# Altium schematic sheet USB_HUB1 DN PORT 3.SchDoc: USB_HUB 3.0
size A2; DrawnBy: Luca Schenetti; Revision: A; SheetNumber: 7; SheetTotal: 10
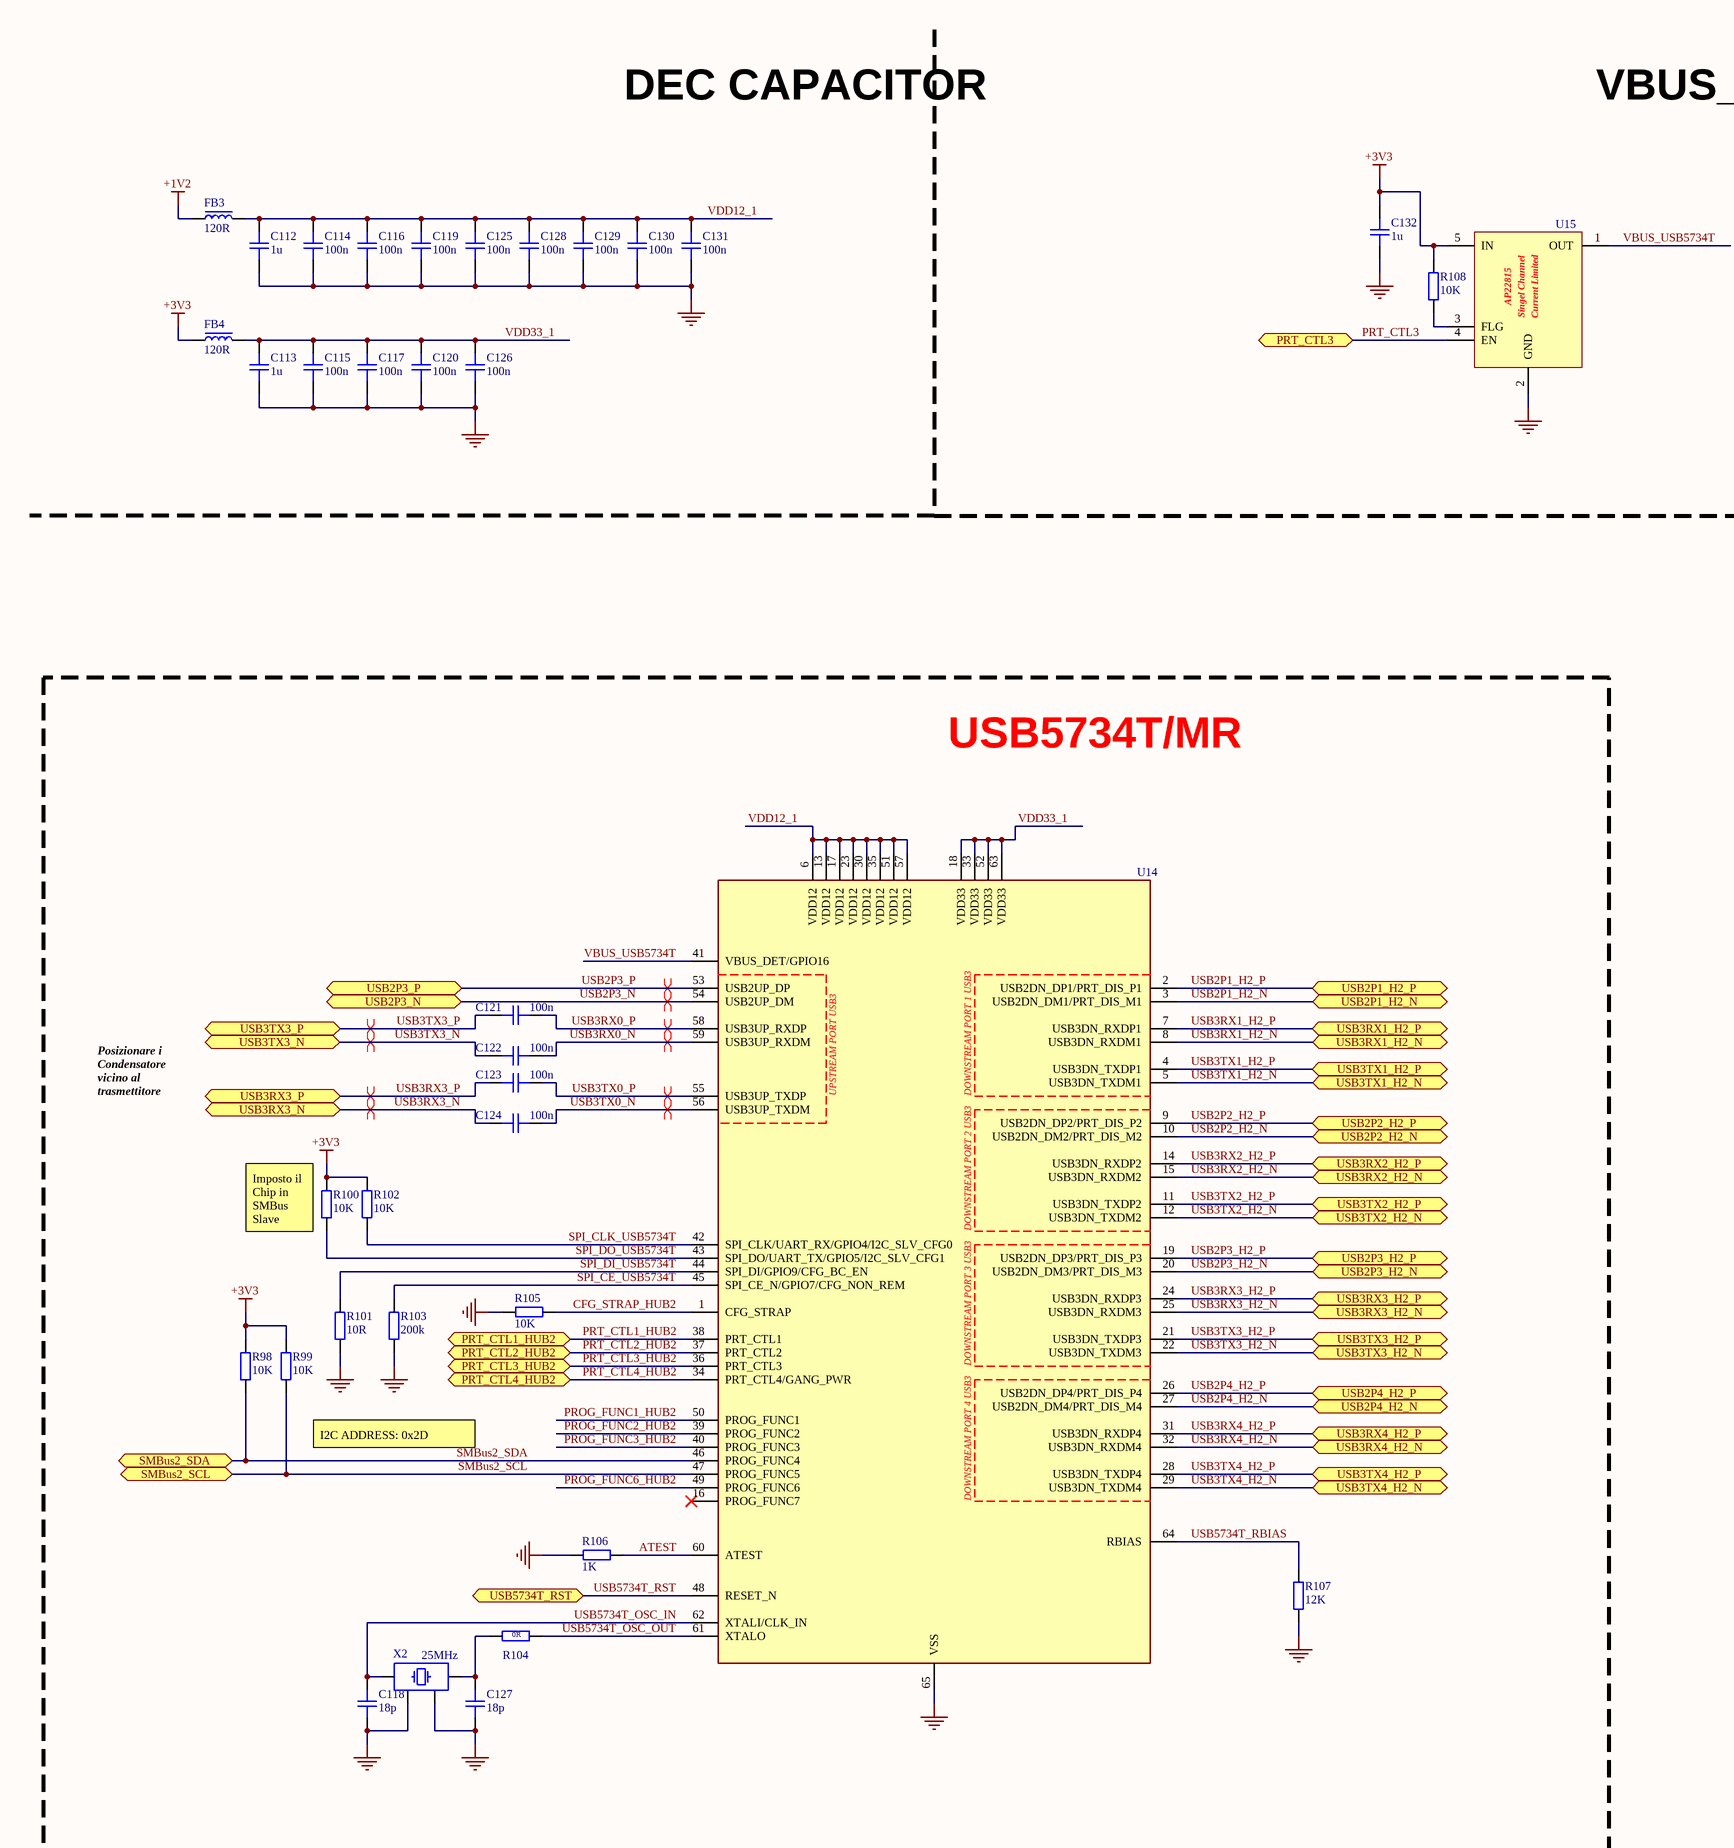
[diagram p0: USB_HUB1 DN PORT 3.SchDoc, left]
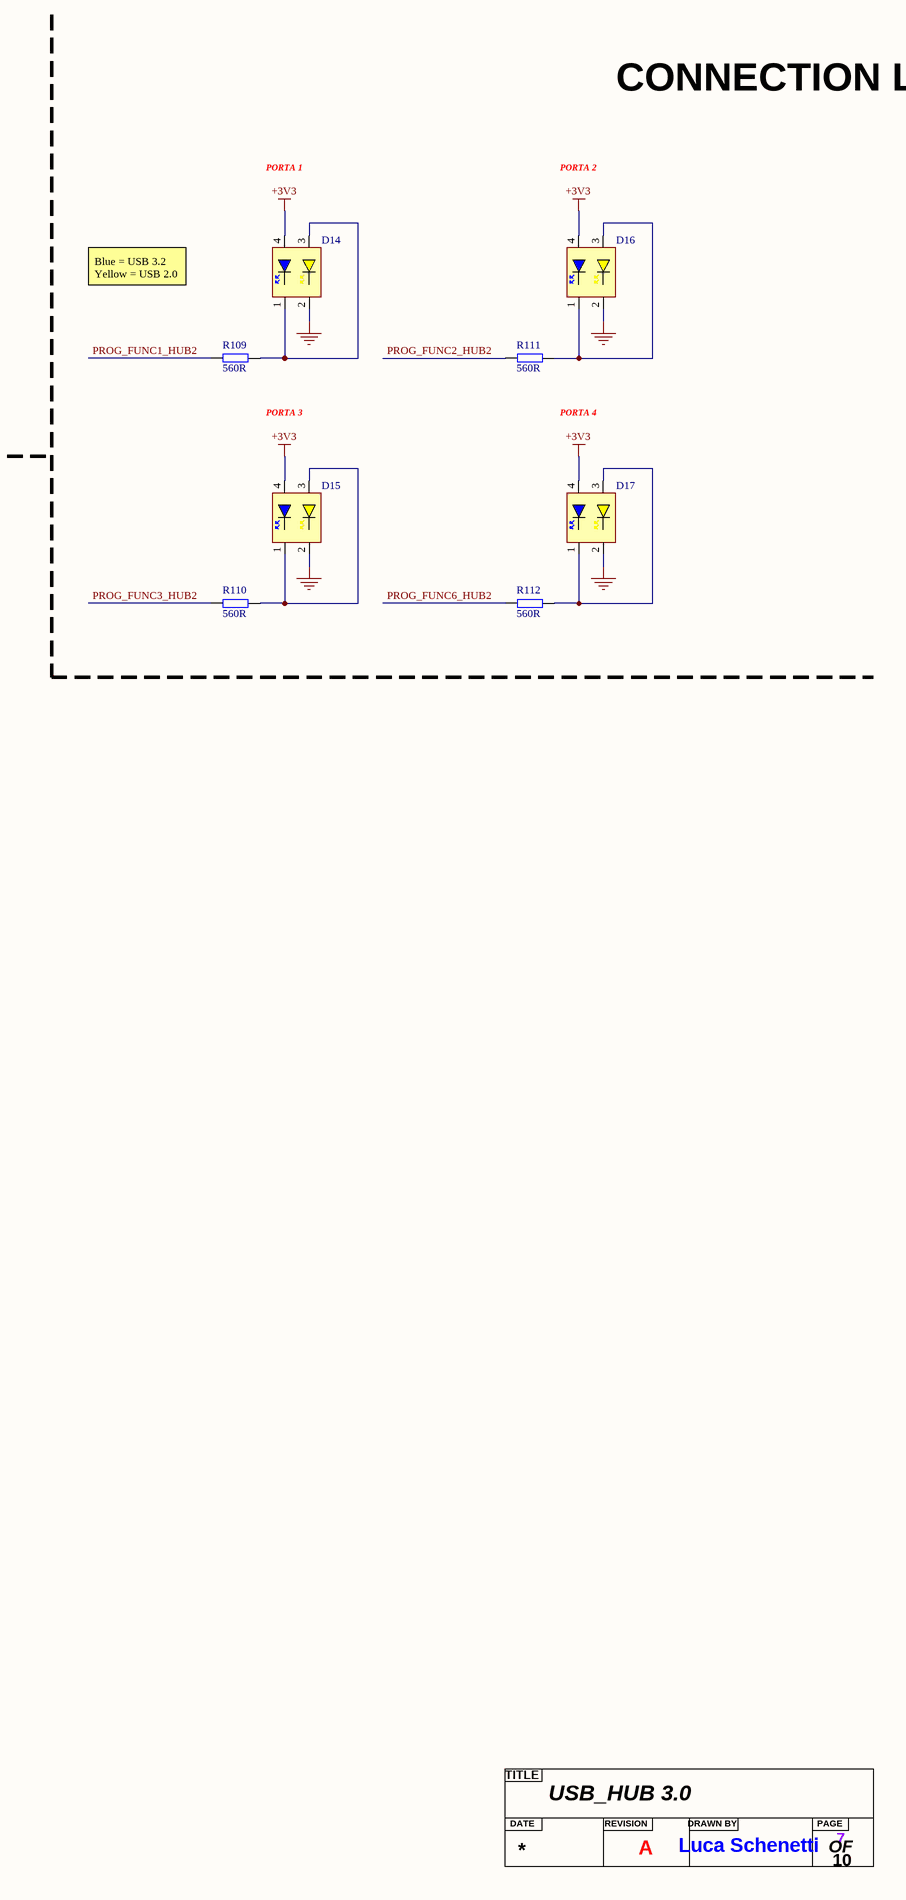
[diagram p1: USB_HUB1 DN PORT 3.SchDoc, right]

## Parts
?  Title  (value not drawn)  (graphical)
C112  1u  [CAP_0603]
C113  1u  [CAP_0603]
C114  100n  [CAP_0603]
C115  100n  [CAP_0603]
C116  100n  [CAP_0603]
C117  100n  [CAP_0603]
C118  18p  [CAP_0402]
C119  100n  [CAP_0603]
C120  100n  [CAP_0603]
C121  100n  [CAP_0402]
C122  100n  [CAP_0402]
C123  100n  [CAP_0402]
C124  100n  [CAP_0402]
C125  100n  [CAP_0603]
C126  100n  [CAP_0603]
C127  18p  [CAP_0402]
C128  100n  [CAP_0603]
C129  100n  [CAP_0603]
C130  100n  [CAP_0603]
C131  100n  [CAP_0603]
C132  1u  [CAP_0603]
D14  TWO LED Yellow Blue 0603  [A-SP1962Y3B1C-C01-3T]  (value not drawn)
D15  TWO LED Yellow Blue 0603  [A-SP1962Y3B1C-C01-3T]  (value not drawn)
D16  TWO LED Yellow Blue 0603  [A-SP1962Y3B1C-C01-3T]  (value not drawn)
D17  TWO LED Yellow Blue 0603  [A-SP1962Y3B1C-C01-3T]  (value not drawn)
FB3  120R  [FB_0603]
FB4  120R  [FB_0603]
R98  10K  [RES_0603]
R99  10K  [RES_0603]
R100  10K  [RES_0603]
R101  10R  [RES_0603]
R102  10K  [RES_0603]
R103  200k  [RES_0603]
R104  0R  [RES_0402]
R105  10K  [RES_0603]
R106  1K  [RES_0603]
R107  12K  [RES_0603]
R108  10K  [RES_0603]
R109  560R  [RES_0603]
R110  560R  [RES_0603]
R111  560R  [RES_0603]
R112  560R  [RES_0603]
U14  4-Port SS/HS USB Controller Hub  [USB5734T/MR]  (value not drawn)
U15  Single-Channel, Current-Limited  [AP22815]  (value not drawn)
X2  25MHz  [XTAL_3225]

## Blocks framed on the sheet
USB5734T/MR: C118 C121-C124 C127 R98-R107 U14 X2

## Ports
PRT_CTL1_HUB2 (bidir, see USB_HUB2 DN PORT[2C]), PRT_CTL2_HUB2 (bidir, see USB_HUB2 DN PORT[2D]), PRT_CTL3 (bidir, see USB_HUB1[6D]), PRT_CTL3_HUB2 (bidir, see USB_HUB2 DN PORT[5C]), PRT_CTL4_HUB2 (bidir, see USB_HUB2 DN PORT[5D]), SMBus2_SCL (bidir, see MCU[4D]), SMBus2_SDA (bidir, see MCU[4C]), USB2P1_H2_N (bidir, see USB_HUB2 DN PORT[3A], USB_HUB2 DN PORT[3B]), USB2P1_H2_P (bidir, see USB_HUB2 DN PORT[3A], USB_HUB2 DN PORT[3B]), USB2P2_H2_N (bidir, see USB_HUB2 DN PORT[3A], USB_HUB2 DN PORT[3B]), USB2P2_H2_P (bidir, see USB_HUB2 DN PORT[3A], USB_HUB2 DN PORT[3B]), USB2P3_H2_N (bidir, see USB_HUB2 DN PORT[6B], USB_HUB2 DN PORT[7A]), USB2P3_H2_P (bidir, see USB_HUB2 DN PORT[6B], USB_HUB2 DN PORT[7A]), USB2P3_N (bidir, see USB_HUB1[6C]), USB2P3_P (bidir, see USB_HUB1[6C]), USB2P4_H2_N (bidir, see USB_HUB2 DN PORT[6B], USB_HUB2 DN PORT[7A]), USB2P4_H2_P (bidir, see USB_HUB2 DN PORT[6B], USB_HUB2 DN PORT[7A]), USB3RX1_H2_N (bidir, see USB_HUB2 DN PORT[3A]), USB3RX1_H2_P (bidir, see USB_HUB2 DN PORT[3A]), USB3RX2_H2_N (bidir, see USB_HUB2 DN PORT[3A]), USB3RX2_H2_P (bidir, see USB_HUB2 DN PORT[3A]), USB3RX3_H2_N (bidir, see USB_HUB2 DN PORT[7A]), USB3RX3_H2_P (bidir, see USB_HUB2 DN PORT[7A]), USB3RX3_N (bidir, see USB_HUB1[6C]), USB3RX3_P (bidir, see USB_HUB1[6C]), USB3RX4_H2_N (bidir, see USB_HUB2 DN PORT[7A]), USB3RX4_H2_P (bidir, see USB_HUB2 DN PORT[7A]), USB3TX1_H2_N (bidir, see USB_HUB2 DN PORT[3A]), USB3TX1_H2_P (bidir, see USB_HUB2 DN PORT[3A]), USB3TX2_H2_N (bidir, see USB_HUB2 DN PORT[3A]), USB3TX2_H2_P (bidir, see USB_HUB2 DN PORT[3A]), USB3TX3_H2_N (bidir, see USB_HUB2 DN PORT[7A]), USB3TX3_H2_P (bidir, see USB_HUB2 DN PORT[7A]), USB3TX3_N (bidir, see USB_HUB1[6C]), USB3TX3_P (bidir, see USB_HUB1[6C]), USB3TX4_H2_N (bidir, see USB_HUB2 DN PORT[7A]), USB3TX4_H2_P (bidir, see USB_HUB2 DN PORT[7A]), USB5734T_RST (bidir, see MCU[8C])

## Nets
+1V2: FB3.1
+3V3: C132.2 D14.4 D15.4 D16.4 D17.4 FB4.1 R98.2 R99.2 R100.2 R102.2 R108.2 U15.5(IN)
GND: C112.1 C113.1 C114.1 C115.1 C116.1 C117.1 C118.1 C119.1 C120.1 C125.1 C126.1 C127.1 C128.1 C129.1 C130.1 C131.1 C132.1 D14.2 D15.2 D16.2 D17.2 R101.1 R103.1 R105.2 R106.2 R107.1 U14.65(VSS) U15.2(GND) X2.2 X2.4
ATEST: R106.1 U14.60(ATEST)
CFG_STRAP_HUB2: R105.1 U14.1(CFG_STRAP)
PROG_FUNC1_HUB2: R109.2 U14.50(PROG_FUNC1)
PROG_FUNC2_HUB2: R111.2 U14.39(PROG_FUNC2)
PROG_FUNC3_HUB2: R110.2 U14.40(PROG_FUNC3)
PROG_FUNC6_HUB2: R112.2 U14.49(PROG_FUNC6)
PRT_CTL1_HUB2: U14.38(PRT_CTL1) ; port PRT_CTL1_HUB2
PRT_CTL2_HUB2: U14.37(PRT_CTL2) ; port PRT_CTL2_HUB2
PRT_CTL3: U15.4(EN) ; port PRT_CTL3
PRT_CTL3_HUB2: U14.36(PRT_CTL3) ; port PRT_CTL3_HUB2
PRT_CTL4_HUB2: U14.34(PRT_CTL4/GANG_PWR) ; port PRT_CTL4_HUB2
SMBus2_SCL: R99.1 U14.47(PROG_FUNC5) ; port SMBus2_SCL
SMBus2_SDA: R98.1 U14.46(PROG_FUNC4) ; port SMBus2_SDA
SPI_CE_USB5734T: R103.2 U14.45(SPI_CE_N/GPIO7/CFG_NON_REM)
SPI_CLK_USB5734T: R102.1 U14.42(SPI_CLK/UART_RX/GPIO4/I2C_SLV_CFG0)
SPI_DI_USB5734T: R101.2 U14.44(SPI_DI/GPIO9/CFG_BC_EN)
SPI_DO_USB5734T: R100.1 U14.43(SPI_DO/UART_TX/GPIO5/I2C_SLV_CFG1)
USB2P1_H2_N: U14.3(USB2DN_DM1/PRT_DIS_M1) ; port USB2P1_H2_N
USB2P1_H2_P: U14.2(USB2DN_DP1/PRT_DIS_P1) ; port USB2P1_H2_P
USB2P2_H2_N: U14.10(USB2DN_DM2/PRT_DIS_M2) ; port USB2P2_H2_N
USB2P2_H2_P: U14.9(USB2DN_DP2/PRT_DIS_P2) ; port USB2P2_H2_P
USB2P3_H2_N: U14.20(USB2DN_DM3/PRT_DIS_M3) ; port USB2P3_H2_N
USB2P3_H2_P: U14.19(USB2DN_DP3/PRT_DIS_P3) ; port USB2P3_H2_P
USB2P3_N: U14.54(USB2UP_DM) ; port USB2P3_N
USB2P3_P: U14.53(USB2UP_DP) ; port USB2P3_P
USB2P4_H2_N: U14.27(USB2DN_DM4/PRT_DIS_M4) ; port USB2P4_H2_N
USB2P4_H2_P: U14.26(USB2DN_DP4/PRT_DIS_P4) ; port USB2P4_H2_P
USB3RX0_N: C122.1 U14.59(USB3UP_RXDM)
USB3RX0_P: C121.1 U14.58(USB3UP_RXDP)
USB3RX1_H2_N: U14.8(USB3DN_RXDM1) ; port USB3RX1_H2_N
USB3RX1_H2_P: U14.7(USB3DN_RXDP1) ; port USB3RX1_H2_P
USB3RX2_H2_N: U14.15(USB3DN_RXDM2) ; port USB3RX2_H2_N
USB3RX2_H2_P: U14.14(USB3DN_RXDP2) ; port USB3RX2_H2_P
USB3RX3_H2_N: U14.25(USB3DN_RXDM3) ; port USB3RX3_H2_N
USB3RX3_H2_P: U14.24(USB3DN_RXDP3) ; port USB3RX3_H2_P
USB3RX3_N: C124.2 ; port USB3RX3_N
USB3RX3_P: C123.2 ; port USB3RX3_P
USB3RX4_H2_N: U14.32(USB3DN_RXDM4) ; port USB3RX4_H2_N
USB3RX4_H2_P: U14.31(USB3DN_RXDP4) ; port USB3RX4_H2_P
USB3TX0_N: C124.1 U14.56(USB3UP_TXDM)
USB3TX0_P: C123.1 U14.55(USB3UP_TXDP)
USB3TX1_H2_N: U14.5(USB3DN_TXDM1) ; port USB3TX1_H2_N
USB3TX1_H2_P: U14.4(USB3DN_TXDP1) ; port USB3TX1_H2_P
USB3TX2_H2_N: U14.12(USB3DN_TXDM2) ; port USB3TX2_H2_N
USB3TX2_H2_P: U14.11(USB3DN_TXDP2) ; port USB3TX2_H2_P
USB3TX3_H2_N: U14.22(USB3DN_TXDM3) ; port USB3TX3_H2_N
USB3TX3_H2_P: U14.21(USB3DN_TXDP3) ; port USB3TX3_H2_P
USB3TX3_N: C122.2 ; port USB3TX3_N
USB3TX3_P: C121.2 ; port USB3TX3_P
USB3TX4_H2_N: U14.29(USB3DN_TXDM4) ; port USB3TX4_H2_N
USB3TX4_H2_P: U14.28(USB3DN_TXDP4) ; port USB3TX4_H2_P
USB5734T_OSC_IN: C118.2 U14.62(XTALI/CLK_IN) X2.3
USB5734T_OSC_OUT: R104.2 U14.61(XTALO)
USB5734T_RBIAS: R107.2 U14.64(RBIAS)
USB5734T_RST: U14.48(RESET_N) ; port USB5734T_RST
VBUS_USB5734T: U14.41(VBUS_DET/GPIO16) U15.1(OUT)
VDD12_1: C112.2 C114.2 C116.2 C119.2 C125.2 C128.2 C129.2 C130.2 C131.2 FB3.2 U14.6(VDD12) U14.13(VDD12) U14.17(VDD12) U14.23(VDD12) U14.30(VDD12) U14.35(VDD12) U14.51(VDD12) U14.57(VDD12)
VDD33_1: C113.2 C115.2 C117.2 C120.2 C126.2 FB4.2 U14.18(VDD33) U14.33(VDD33) U14.52(VDD33) U14.63(VDD33)
NetC127_2: C127.2 R104.1 X2.1
NetD14_1: D14.1 D14.3 R109.1
NetD15_1: D15.1 D15.3 R110.1
NetD16_1: D16.1 D16.3 R111.1
NetD17_1: D17.1 D17.3 R112.1
NetR108_1: R108.1 U15.3(FLG)

Not connected (* = marked no-connect by the designer): U14 16(PROG_FUNC7)*

## Layout directives
differential pair; differential pair class DIFF_USB_90Ω: USB2P3_N, USB2P3_P, USB3RX0_N, USB3RX0_P, USB3RX3_N, USB3RX3_P, USB3TX0_N, USB3TX0_P, USB3TX3_N, USB3TX3_P

## Notes on the sheet
- DEC CAPACITOR
- VBUS_DET
- CONNECTION LED
- PORTA 1
- PORTA 2
- Blue = USB 3.2
  Yellow = USB 2.0
- PORTA 3
- PORTA 4
- Posizionare i Condensatore vicino al trasmettitore
- (near R100) Imposto il Chip in SMBus Slave
- (near R103) All Ports Are Removable
- (near R99) I2C ADDRESS: 0x2D
- Ports 1, 2, 3, 4 DCP enabled
- (in symbol AP22815AWT-7) AP22815; Singel Channel; Current Limited
- (in symbol Title) TITLE; DATE; REVISION; DRAWN BY; PAGE; OF
- (in symbol USB5734T/MR) UPSTREAM PORT USB3; DOWNSTREAM PORT 1 USB3; DOWNSTREAM PORT 2 USB3; DOWNSTREAM PORT 3 USB3; DOWNSTREAM PORT 4 USB3

## Library data of the parts
C112 C113 C132 = CAP_0603: Capacitor SMD 0603 [C15849]; Manufacturer: *; Manufacturer Part Number: *; Distributor Link: *; LCSC: *; Rating: *; Dielectric: *
C114-C117 C119 C120 C125 C126 C128-C131 = CAP_0603: Capacitor SMD 0603 [C14663]; Manufacturer: *; Manufacturer Part Number: *; Distributor Link: *; LCSC: *; Rating: *; Dielectric: *
C118 C127 = CAP_0402: Capacitor SMD 0402 [C1549]; Manufacturer: *; Manufacturer Part Number: *; Distributor Link: *; LCSC: *; Rating: *; Dielectric: *
C121-C124 = CAP_0402: Capacitor SMD 0402[C1525]; Manufacturer: *; Manufacturer Part Number: *; Distributor Link: *; LCSC: *; Rating: *; Dielectric: *
D14-D17 = A-SP1962Y3B1C-C01-3T: [C19171299]
FB3 FB4 = FB_0603: Ferrite Bead SMD 0603[C76892]; Manufacturer: *; Manufacturer Part Number: *; Distributor Link: *; LCSC: *
R98-R100 R102 R105 = RES_0603: Resistor SMD 0603[C25804]; Manufacturer: *; Manufacturer Part Number: *; Distributor Link: *; LCSC: *
R101 = RES_0603: Resistor SMD 0603[C22859]; Manufacturer: *; Manufacturer Part Number: *; Distributor Link: *; LCSC: *
R103 = RES_0603: Resistor SMD 0603[C25811]; Manufacturer: *; Manufacturer Part Number: *; Distributor Link: *; LCSC: *
R104 = RES_0402: Resistor SMD 0402 [C17168]; Manufacturer: *; Manufacturer Part Number: *; Distributor Link: *; LCSC: *
R106 = RES_0603: [C21190]; Manufacturer: *; Manufacturer Part Number: *; Distributor Link: *; LCSC: *
R107 = RES_0603: [C22790]; Manufacturer: *; Manufacturer Part Number: *; Distributor Link: *; LCSC: *
R108 = RES_0603: [C25804]; Manufacturer: *; Manufacturer Part Number: *; Distributor Link: *; LCSC: *
R109-R112 = RES_0603: [C23204]; Manufacturer: *; Manufacturer Part Number: *; Distributor Link: *; LCSC: *
U14 = USB5734T/MR: [C626710]
U15 = AP22815AWT-7: [C2150007]
X2 = TSX-3225_24.0000MF15X-AC: Crystal SMD 24MHz 10PPM 7pF 3225 [C9006]; Manufacturer: Epson; Manufacturer Part Number: TSX-3225 24.0000MF15X-AC